# Altium schematic sheet power_regulator.SchDoc: Arduino Uno Shield
size A4; DrawnBy: Sreerag S; Revision: Rev 1.0; SheetNumber: 1; SheetTotal: 1
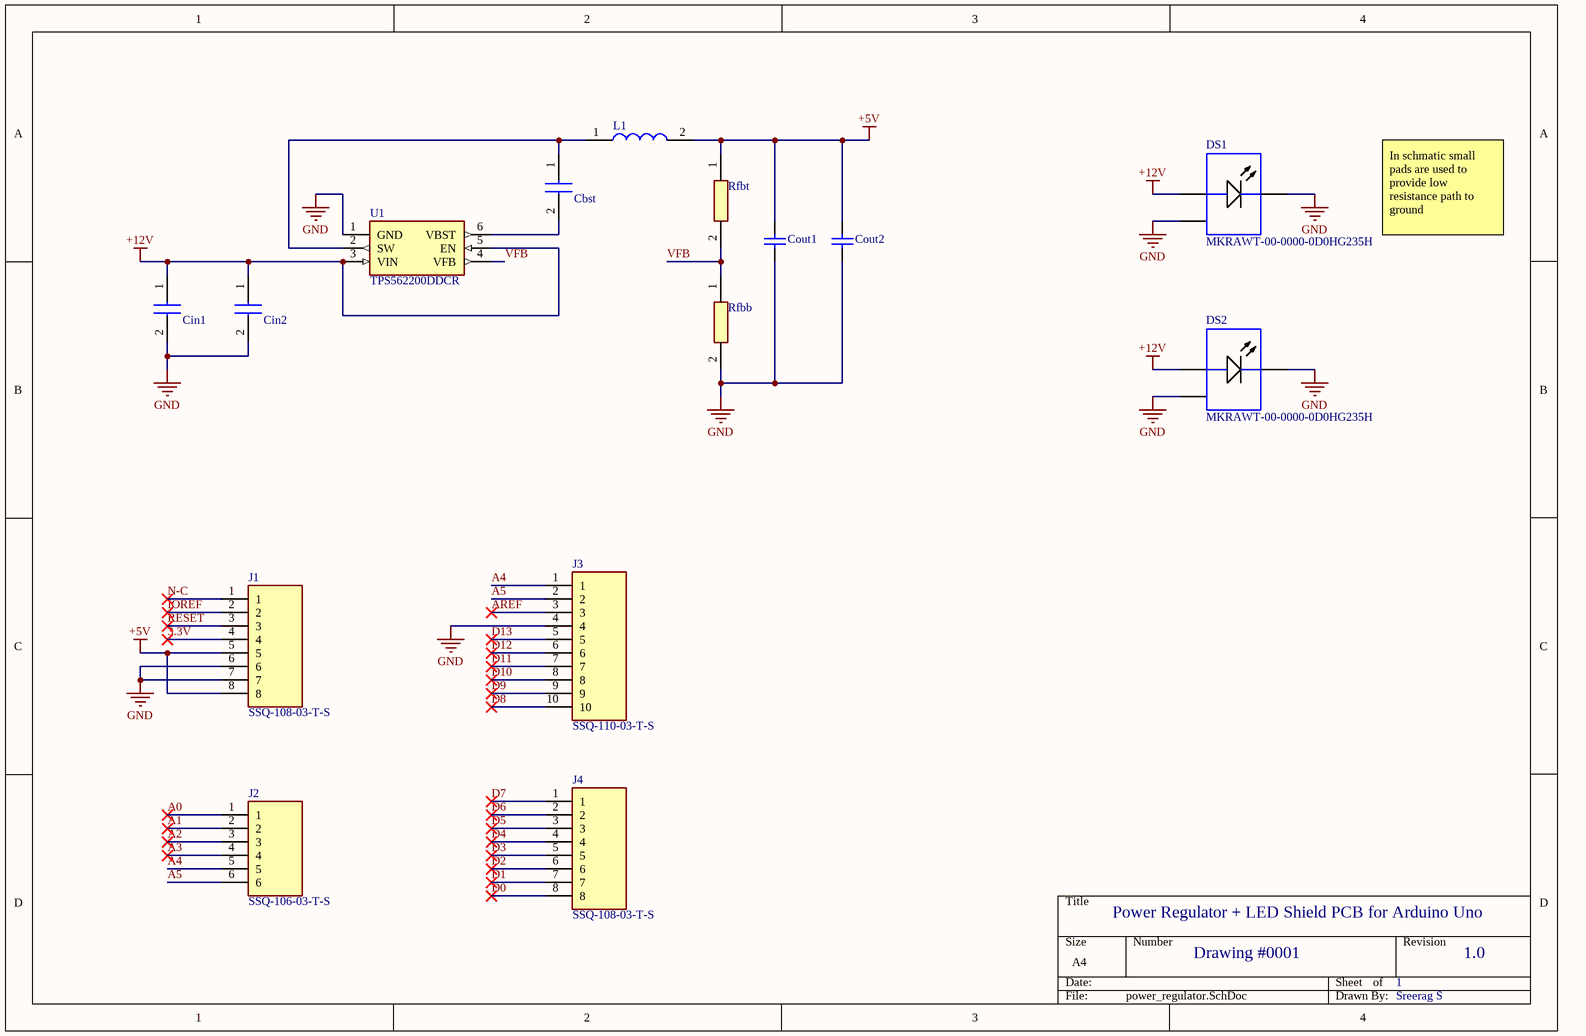
[diagram p0: power_regulator.SchDoc]

## Parts
Cbst  08053C104KAT2A  [CAPC2012X94N]  (value not drawn)
Cin1  C2012X5R1V106K085AC  [C2012_Commercial]  (value not drawn)
Cin2  C2012X5R1V106K085AC  [C2012_Commercial]  (value not drawn)
Cout1  C1608X5R1A226M080AC  [CAPC1608X100X20ML10]  (value not drawn)
Cout2  C1608X5R1A226M080AC  [CAPC1608X100X20ML10]  (value not drawn)
DS1  MKRAWT-00-0000-0D0HG235H  [CREE-MK-R-2_V]
DS2  MKRAWT-00-0000-0D0HG235H  [CREE-MK-R-2_V]
J1  SSQ-108-03-T-S  [RHDR8W64P254_1X8_2083X241X851P]
J2  SSQ-106-03-T-S  [RHDR6W64P254_1X6_1575X241X851P]
J3  SSQ-110-03-T-S  [RHDR10W64P254_1X10_2591X241X851P]
J4  SSQ-108-03-T-S  [RHDR8W64P254_1X8_2083X241X851P]
L1  SRN6045-4R7Y  [SRN6045_1]  (value not drawn)
Rfbb  RC0201FR-0710KL  [RESC0603X26N]  (value not drawn)
Rfbt  RC0201FR-0756K2L  [RESC0603X26N]  (value not drawn)
U1  TPS562200DDCR  [SOT95P280X110-6N]

## Nets
+5V: Cout1.2 Cout2.2 J1.5 J1.8 L1.2 Rfbt.1
+12V: Cin1.1 Cin2.1 DS1.1(A) DS2.1(A) U1.3(VIN) U1.5(EN)
GND: Cin1.2 Cin2.2 Cout1.1 Cout2.1 DS1.2(K) DS1.3(EP) DS2.2(K) DS2.3(EP) J1.6 J1.7 J3.4 Rfbb.2 U1.1(GND)
3.3V: J1.4
A0: J2.1
A1: J2.2
A2: J2.3
A3: J2.4
A4: J2.5 J3.1
A5: J2.6 J3.2
AREF: J3.3
D0: J4.8
D1: J4.7
D2: J4.6
D3: J4.5
D4: J4.4
D5: J4.3
D6: J4.2
D7: J4.1
D8: J3.10
D9: J3.9
D10: J3.8
D11: J3.7
D12: J3.6
D13: J3.5
IOREF: J1.2
N-C: J1.1
RESET: J1.3
VFB: Rfbb.1 Rfbt.2 U1.4(VFB)
NetCbst_1: Cbst.1 L1.1 U1.2(SW)
NetCbst_2: Cbst.2 U1.6(VBST)

## Notes on the sheet
- In schmatic small pads are used to provide low resistance path to ground
- Power Regulator + LED Shield PCB for Arduino Uno
- Drawing #0001
- 1
- 1.0
- Sreerag S

## Library data of the parts
Cbst = 08053C104KAT2A: Capacitor; Manufacturer_Name: Kyocera AVX; Datasheet Link: http://datasheets.avx.com/X7RDielectric.pdf; Height: 0.94mm; Manufacturer_Part_Number: 08053C104KAT2A; Mouser Part Number: 581-08053C104K; Mouser Price/Stock: https://www.mouser.co.uk/ProductDetail/KYOCERA-AVX/08053C104KAT2A?qs=EihRZLdKnF2GcTBzDkE%2FiQ%3D%3D; Arrow Part Number: 08053C104KAT2A; Arrow Price/Stock: https://www.arrow.com/en/products/08053c104kat2a/avx?utm_currency=USD&region=nac
Cin1 Cin2 = C2012X5R1V106K085AC: Capacitor; Manufacturer_Name: TDK; Datasheet Link: https://product.tdk.com/system/files/dam/doc/product/capacitor/ceramic/mlcc/catalog/mlcc_commercial_general_en.pdf; Height: 0.75mm; Manufacturer_Part_Number: C2012X5R1V106K085AC; Mouser Part Number: 810-C2012X5R1V106K0C; Mouser Price/Stock: https://www.mouser.co.uk/ProductDetail/TDK/C2012X5R1V106K085AC?qs=6JAMGB%252BEdky%252BlYMcTLhFyA%3D%3D; Arrow Part Number: C2012X5R1V106K085AC; Arrow Price/Stock: https://www.arrow.com/en/products/c2012x5r1v106k085ac/tdk?region=nac
Cout1 Cout2 = CMP-2000-05441-1: Chip Capacitor, 22 uF, +/- 20%, 10 V, -55 to 85 degC, 0603 (1608 Metric), RoHS, Tape and Reel; Manufacturer: TDK; PCN Part Number: MLCCPartNumberChange30/Nov/2012; Voltage - Rated: 10V; Product Training Modules: CSeriesGeneralApplicationsSEAT,CCV,andTVCLDesignToolsGuidetoReplacinganElectrolyticCapacitorwithanMLCC; Other Names: 445-9077-1; Design Resources: 20WNon-IsolatedBuckLEDDriverUsingPLLNK460KG; Online Catalog: CSeries,GeneralPurpose; Capacitance: 22µF; Temperature Coefficient: X5R; Kits: 445-9014-KIT-ND-KITMLCC100PF-22UF060310-50V; Packaging: CutTape(CT); Standard Package: 1; Package / Case: 0603(1608Metric); Lead Style: -; Features: -; Ratings: -; Operating Temperature: -55degC~85degC; Applications: GeneralPurpose; Package Reference: 603; Datasheet URL: http://download.siliconexpert.com/pdfs/2015/4/21/15/54/45/779/tdk_/manual/37024850441143360mlcc_commercial_general_en.pdf; Datasheet Version: Mar-15; Mounting Type: SurfaceMount,MLCC; Lead Spacing: -; Size / Dimension: 0.063"Lx0.031"W(1.60mmx0.80mm); Height - Seated (Max): -; Package Description: 2-Pin Surface Mount Device, Body 1.6 x 0.8 mm; Manufacturer URL: http://www.tdk.com/; RoHS Information: RoHSCertificate-MLCC; Tolerance: ±20%; Series: C; Thickness (Max): 0.035"(0.90mm); Family: CeramicCapacitors; Category: Capacitors
DS1 DS2 = CMP-2100-00977-1: LED, White, 12 V, 2-Pin SMD, RoHS, Tape and Reel
J1 J4 = SSQ-108-03-T-S: Connector; Manufacturer_Name: SAMTEC; Datasheet Link: http://suddendocs.samtec.com/prints/ssq-1xx-xx-xxx-x-xx-xxx-xx-x-mkt.pdf; Height: 8.51mm; Manufacturer_Part_Number: SSQ-108-03-T-S; Mouser Part Number: 200-SSQ10803TS; Mouser Price/Stock: https://www.mouser.co.uk/ProductDetail/Samtec/SSQ-108-03-T-S?qs=rU5fayqh%252BE3sJVWDTx5zyQ%3D%3D; Arrow Part Number: SSQ-108-03-T-S; Arrow Price/Stock: https://www.arrow.com/en/products/ssq-108-03-t-s/samtec?region=nac
J2 = SSQ-106-03-T-S: Connector; Manufacturer_Name: SAMTEC; Datasheet Link: http://suddendocs.samtec.com/prints/ssq-1xx-xx-xxx-x-xx-xxx-xx-x-mkt.pdf; Height: 8.51mm; Manufacturer_Part_Number: SSQ-106-03-T-S; Mouser Part Number: 200-SSQ10603TS; Mouser Price/Stock: https://www.mouser.co.uk/ProductDetail/Samtec/SSQ-106-03-T-S?qs=rU5fayqh%252BE1MgKYVKa8USw%3D%3D; Arrow Part Number: SSQ-106-03-T-S; Arrow Price/Stock: https://www.arrow.com/en/products/ssq-106-03-t-s/samtec?region=nac
J3 = SSQ-110-03-T-S: Connector; Manufacturer_Name: SAMTEC; Datasheet Link: http://suddendocs.samtec.com/prints/ssq-1xx-xx-xxx-x-xx-xxx-xx-x-mkt.pdf; Height: 8.51mm; Manufacturer_Part_Number: SSQ-110-03-T-S; Mouser Part Number: 200-SSQ11003TS; Mouser Price/Stock: https://www.mouser.co.uk/ProductDetail/Samtec/SSQ-110-03-T-S?qs=rU5fayqh%252BE0uAJE8UTgxfA%3D%3D; Arrow Part Number: SSQ-110-03-T-S; Arrow Price/Stock: https://www.arrow.com/en/products/ssq-110-03-t-s/samtec?region=nac
L1 = SRN6045-4R7Y: Inductor; Manufacturer_Name: Bourns; Datasheet Link: https://www.bourns.com/data/global/pdfs/SRN6045.pdf; Manufacturer_Part_Number: SRN6045-4R7Y; Mouser Part Number: 652-SRN6045-4R7Y; Mouser Price/Stock: https://www.mouser.co.uk/ProductDetail/Bourns/SRN6045-4R7Y?qs=opBjA1TV902tB4tumIiZhg%3D%3D; Arrow Part Number: SRN6045-4R7Y; Arrow Price/Stock: https://www.arrow.com/en/products/srn6045-4r7y/bourns?utm_currency=USD&region=nac
Rfbb = RC0201FR-0710KL: Resistor; Manufacturer_Name: KEMET; Datasheet Link: http://www.yageo.com/documents/recent/PYu-RC0201_51_RoHS_L_8.pdf; Height: 0.26mm; Manufacturer_Part_Number: RC0201FR-0710KL; Mouser Part Number: 603-RC0201FR-0710KL; Mouser Price/Stock: https://www.mouser.co.uk/ProductDetail/YAGEO/RC0201FR-0710KL?qs=FLc6udek5PS1AiJCgpc6bQ%3D%3D
Rfbt = RC0201FR-0756K2L: Resistor; Manufacturer_Name: KEMET; Datasheet Link: http://www.yageo.com/documents/recent/PYu-RC0201_51_RoHS_L_8.pdf; Height: 0.26mm; Manufacturer_Part_Number: RC0201FR-0756K2L; Mouser Part Number: 603-RC0201FR-0756K2L; Mouser Price/Stock: https://www.mouser.co.uk/ProductDetail/YAGEO/RC0201FR-0756K2L?qs=Q4gDqC5t5%2FD3%2Fkjmz2Nr%2Fw%3D%3D; Arrow Part Number: RC0201FR-0756K2L; Arrow Price/Stock: https://www.arrow.com/en/products/rc0201fr-0756k2l/yageo?region=nac
U1 = TPS562200DDCR: Undefined or Miscellaneous; Manufacturer_Name: Texas Instruments; Datasheet Link: http://www.ti.com/lit/gpn/tps562200; Height: 1.1mm; Manufacturer_Part_Number: TPS562200DDCR; Mouser Part Number: 595-TPS562200DDCR; Mouser Price/Stock: https://www.mouser.co.uk/ProductDetail/Texas-Instruments/TPS562200DDCR?qs=7wMBv%2Ftbz9Jdis0htpD4wA%3D%3D; Arrow Part Number: TPS562200DDCR; Arrow Price/Stock: https://www.arrow.com/en/products/tps562200ddcr/texas-instruments?region=europe